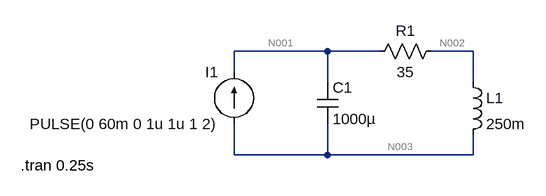
[diagram p0: schematic P3_E.asc]
P3_E.asc, the LTspice schematic file:
Version 4.1
SHEET 1 880 680
WIRE 176 96 32 96
WIRE 256 96 176 96
WIRE 400 96 336 96
WIRE 32 128 32 96
WIRE 176 144 176 96
WIRE 400 144 400 96
WIRE 32 256 32 208
WIRE 176 256 176 208
WIRE 176 256 32 256
WIRE 400 256 400 224
WIRE 400 256 176 256
SYMBOL cap 160 144 R0
SYMATTR InstName C1
SYMATTR Value 1000µ
SYMBOL ind 384 128 R0
SYMATTR InstName L1
SYMATTR Value 250m
SYMBOL res 352 80 R90
WINDOW 0 0 56 VBottom 2
WINDOW 3 32 56 VTop 2
SYMATTR InstName R1
SYMATTR Value 35
SYMBOL current 32 208 R180
WINDOW 0 24 80 Left 2
WINDOW 3 24 0 Left 2
WINDOW 123 0 0 Left 0
WINDOW 39 0 0 Left 0
SYMATTR InstName I1
SYMATTR Value PULSE(0 60m 0 1u 1u 1 2)
TEXT -296 272 Left 2 !.tran 0.25s

The netlist it stands for:
* P3_E.asc
C1 N001 N003 1000µ
L1 N002 N003 250m
R1 N002 N001 35
I1 N003 N001 PULSE(0 60m 0 1u 1u 1 2)
.tran 0.25s
.backanno
.end

* Results of the author's LTspice run, read from the files saved beside the schematic
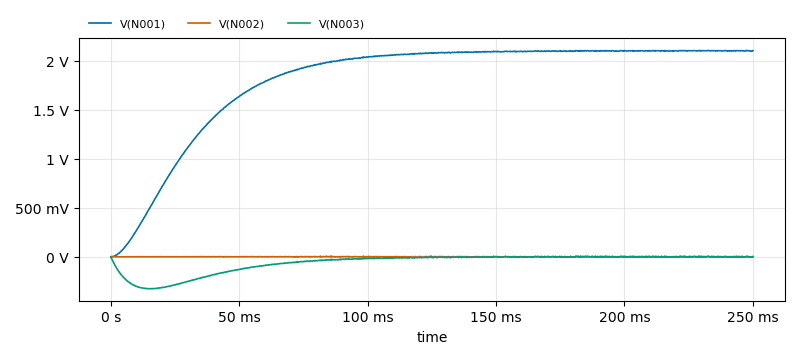
[diagram p1: Transient Analysis of P3_E.asc, plotted from the saved traces]
* Transient Analysis, 1 run:
*   V(N001): min -120.5 µV, max 2.105 V, average 1.806 V, rms 1.884 V, last 2.101 V
*   V(N002): min -4.239 mV, max 5.231 mV, average 477.6 µV, rms 1.702 mV, last 1.541 mV
*   V(N003): min -326.4 mV, max 4.823 mV, average -59.57 mV, rms 113.2 mV, last 1.436 mV